# EAGLE schematic APSR3350 (EAGLE 9.5.0)
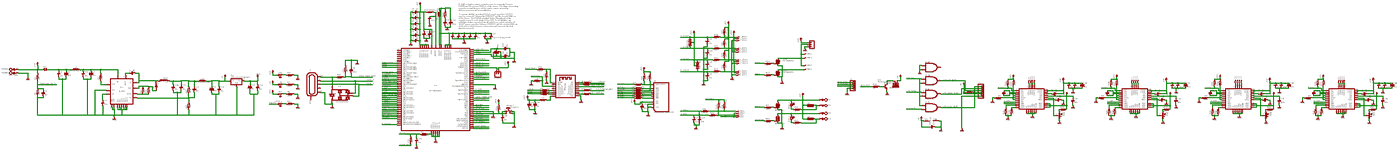
[diagram p0: schematic, sheet 1, overview]
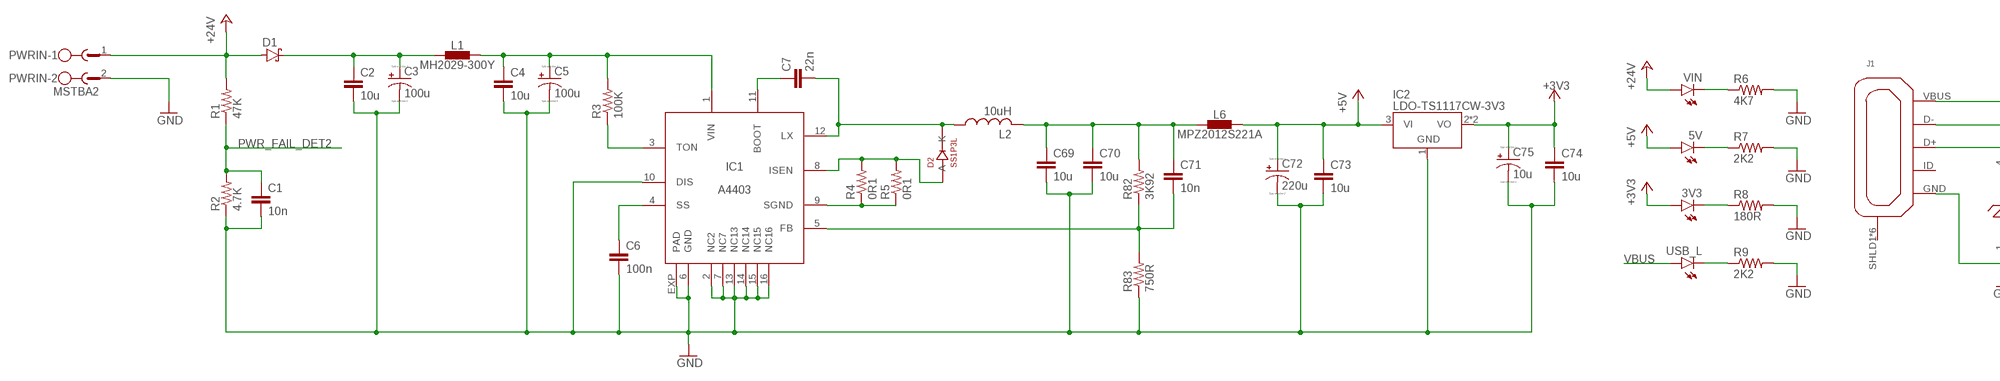
[diagram p1: schematic, sheet 1, part 1 of 5]
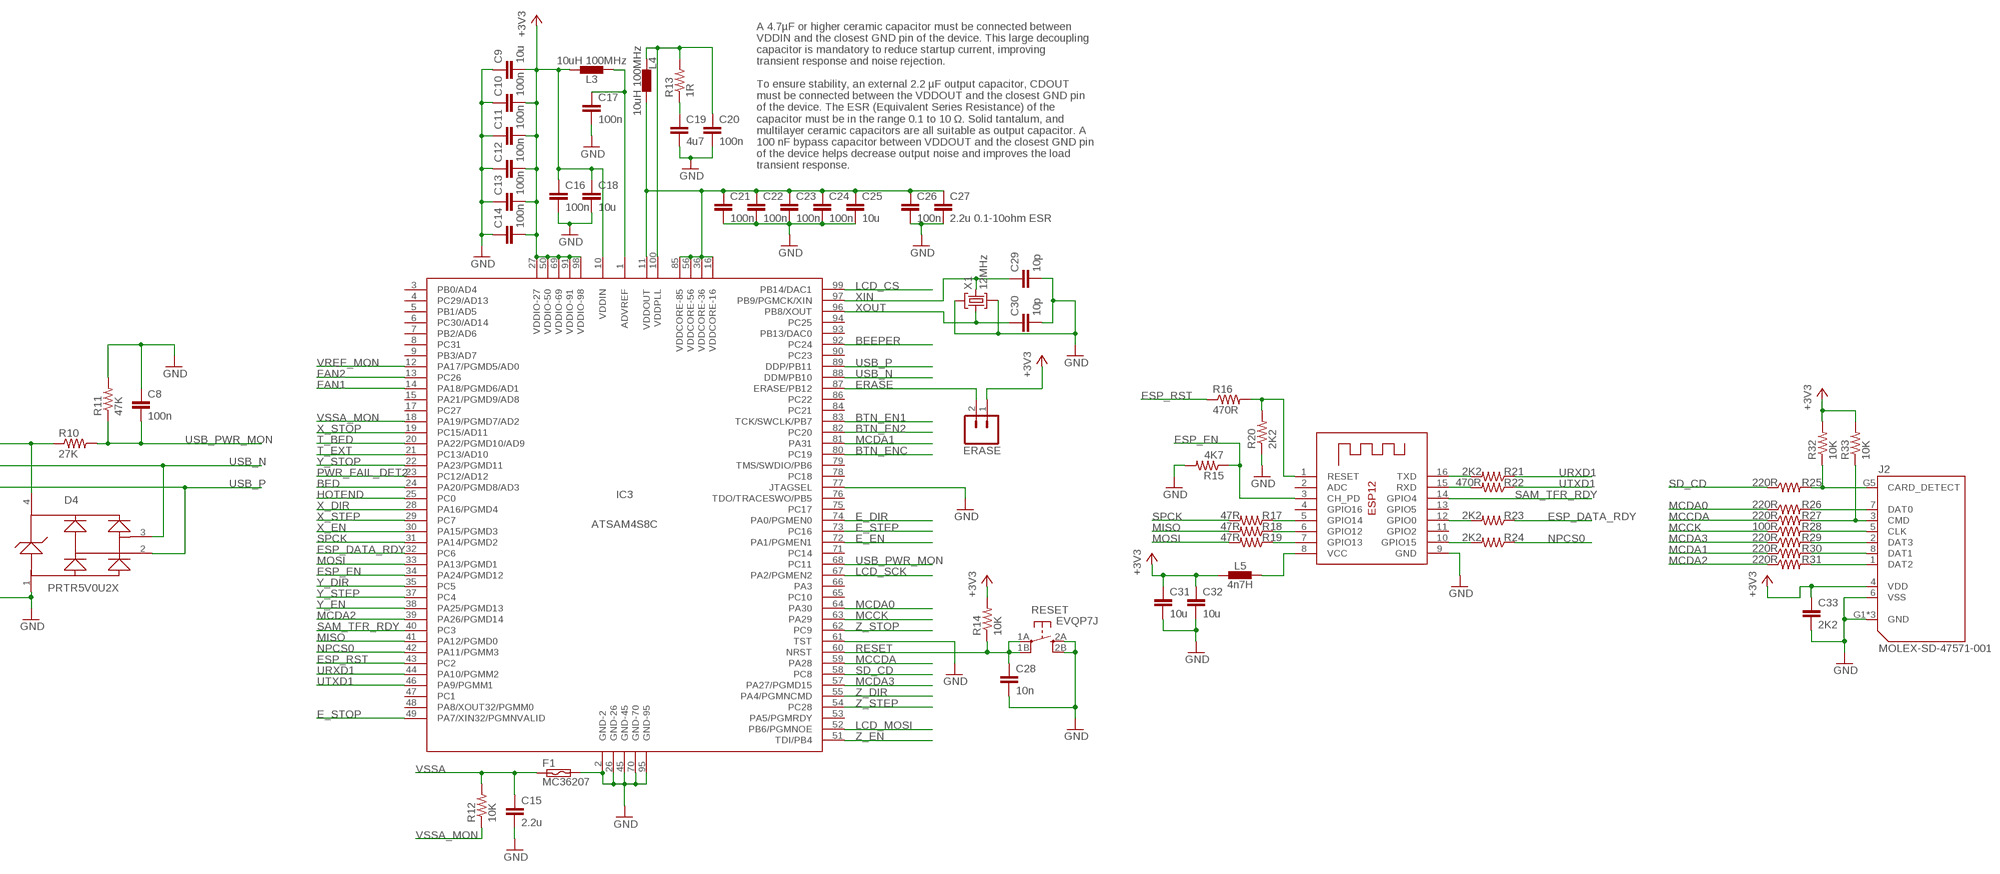
[diagram p2: schematic, sheet 1, part 2 of 5]
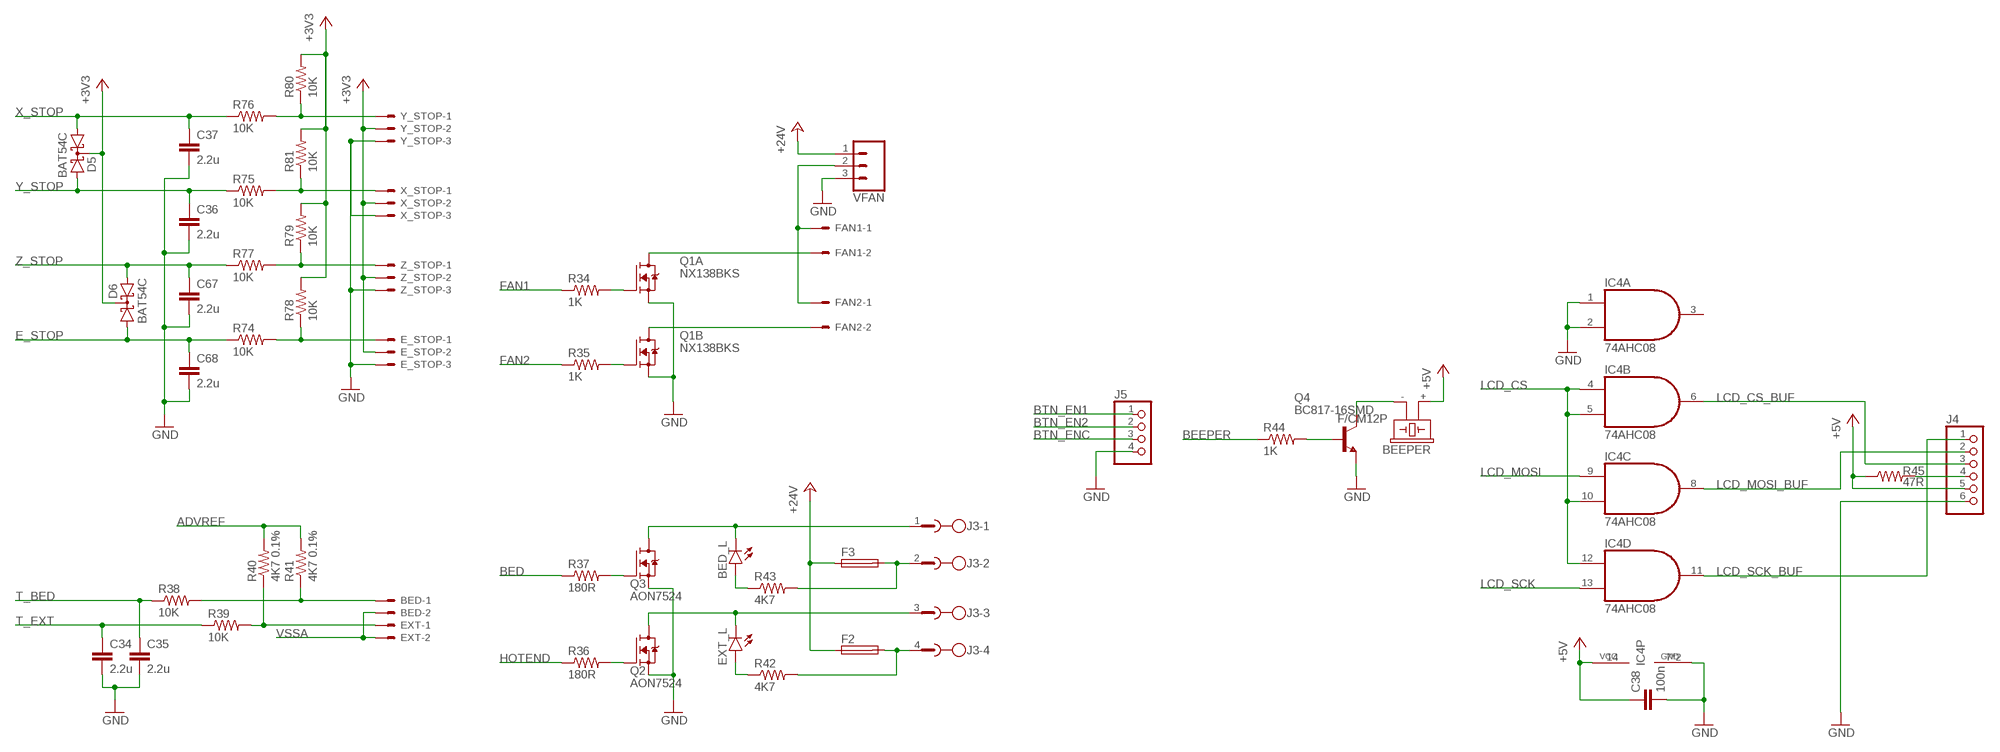
[diagram p3: schematic, sheet 1, part 3 of 5]
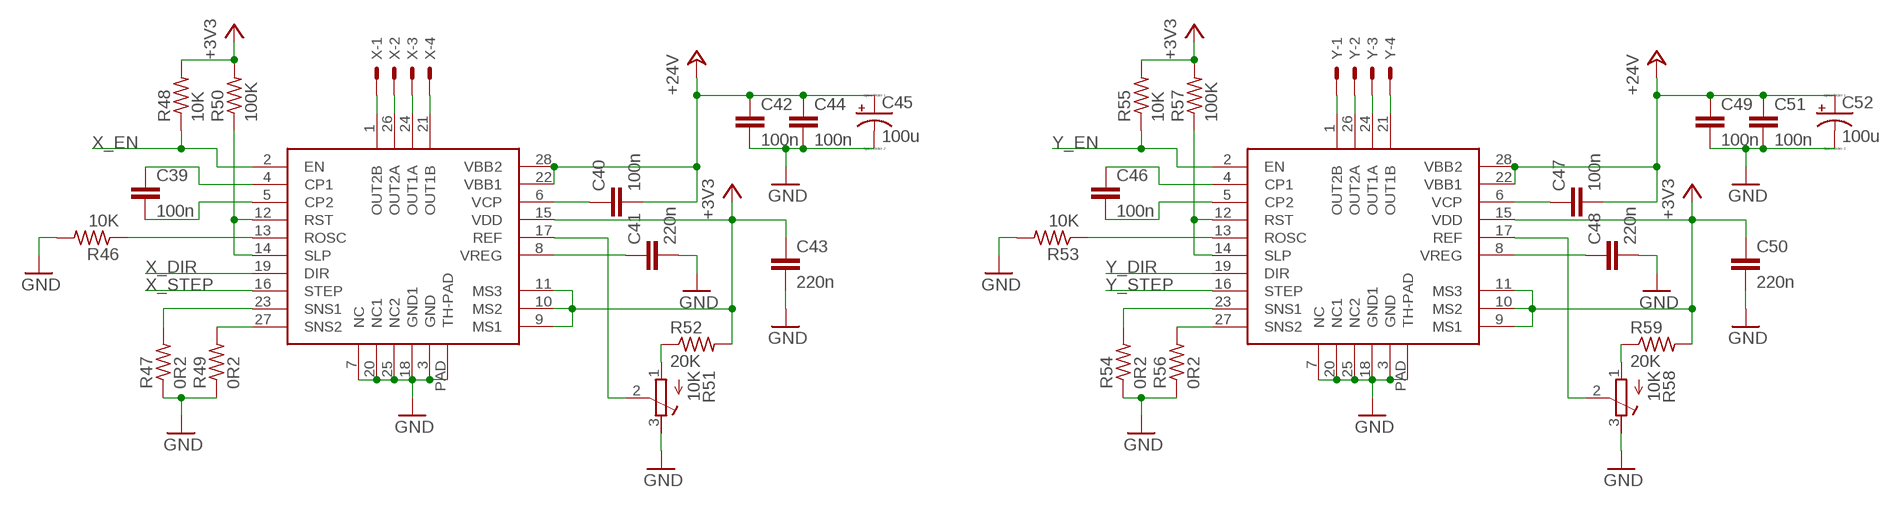
[diagram p4: schematic, sheet 1, part 4 of 5]
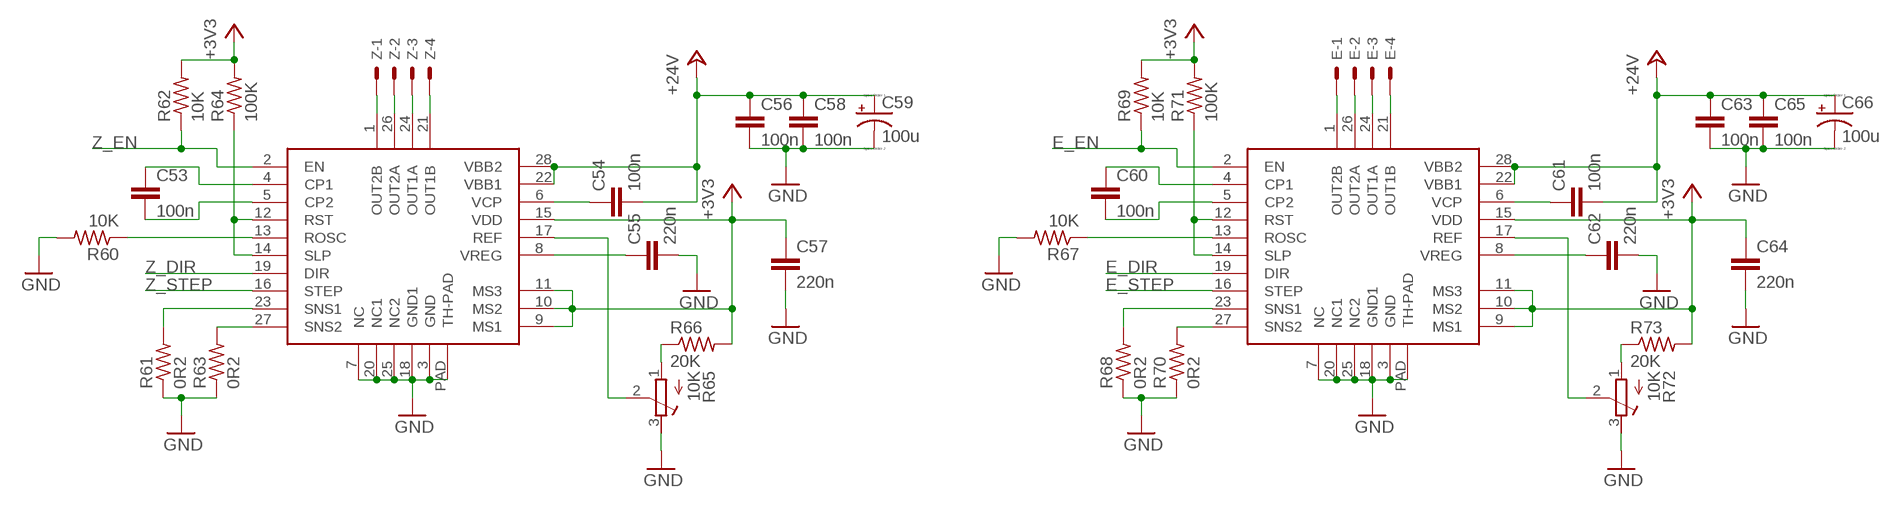
[diagram p5: schematic, sheet 1, part 5 of 5]

## Parts
3V3  LEDCHIPLED_0805  [CHIPLED_0805]
5V  LEDCHIPLED_0805  [CHIPLED_0805]
BED  KK-254-2  [MOLEX-KK-254-2]
BED_L  LEDCHIPLED_0805  [CHIPLED_0805]
BEEPER  F/CM12P  [F/CM12P]
C1  10n  C-EUC0603  [C0603]
C2  10u  C-EUC0603  [C0603]
C3  100u  CPOL-USD  [PANASONIC_D]
C4  10u  C-EUC0603  [C0603]
C5  100u  CPOL-USD  [PANASONIC_D]
C6  100n  C-EUC0603  [C0603]
C7  22n  C-EUC0603  [C0603]
C8  100n  C-EUC0603  [C0603]
C9  10u  C-EUC0805  [C0805]
C10  100n  C-EUC0603  [C0603]
C11  100n  C-EUC0603  [C0603]
C12  100n  C-EUC0603  [C0603]
C13  100n  C-EUC0603  [C0603]
C14  100n  C-EUC0603  [C0603]
C15  2.2u  C-EUC0603  [C0603]
C16  100n  C-EUC0603  [C0603]
C17  100n  C-EUC0603  [C0603]
C18  10u  C-EUC0603  [C0603]
C19  4u7  C-EUC0603  [C0603]
C20  100n  C-EUC0603  [C0603]
C21  100n  C-EUC0603  [C0603]
C22  100n  C-EUC0603  [C0603]
C23  100n  C-EUC0603  [C0603]
C24  100n  C-EUC0603  [C0603]
C25  10u  C-EUC0805  [C0805]
C26  100n  C-EUC0603  [C0603]
C27  2.2u 0.1-10ohm ESR  C-EUC0603  [C0603]
C28  10n  C-EUC0603  [C0603]
C29  10p  C-EUC0603  [C0603]
C30  10p  C-EUC0603  [C0603]
C31  10u  C-EUC0603  [C0603]
C32  10u  C-EUC0603  [C0603]
C33  2K2  C-EUC0603  [C0603]
C34  2.2u  C-EUC0603  [C0603]
C35  2.2u  C-EUC0603  [C0603]
C36  2.2u  C-EUC0603  [C0603]
C37  2.2u  C-EUC0603  [C0603]
C38  100n  C-EUC0603  [C0603]
C39  100n  C-EUC0603  [C0603]
C40  100n  C-EUC0603  [C0603]
C41  220n  C-EUC0603  [C0603]
C42  100n  C-EUC0603  [C0603]
C43  220n  C-EUC0603  [C0603]
C44  100n  C-EUC0603  [C0603]
C45  100u  CPOL-USD  [PANASONIC_D]
C46  100n  C-EUC0603  [C0603]
C47  100n  C-EUC0603  [C0603]
C48  220n  C-EUC0603  [C0603]
C49  100n  C-EUC0603  [C0603]
C50  220n  C-EUC0603  [C0603]
C51  100n  C-EUC0603  [C0603]
C52  100u  CPOL-USD  [PANASONIC_D]
C53  100n  C-EUC0603  [C0603]
C54  100n  C-EUC0603  [C0603]
C55  220n  C-EUC0603  [C0603]
C56  100n  C-EUC0603  [C0603]
C57  220n  C-EUC0603  [C0603]
C58  100n  C-EUC0603  [C0603]
C59  100u  CPOL-USD  [PANASONIC_D]
C60  100n  C-EUC0603  [C0603]
C61  100n  C-EUC0603  [C0603]
C62  220n  C-EUC0603  [C0603]
C63  100n  C-EUC0603  [C0603]
C64  220n  C-EUC0603  [C0603]
C65  100n  C-EUC0603  [C0603]
C66  100u  CPOL-USD  [PANASONIC_D]
C67  2.2u  C-EUC0603  [C0603]
C68  2.2u  C-EUC0603  [C0603]
C69  10u  C-EUC0603  [C0603]
C70  10u  C-EUC0603  [C0603]
C71  10n  C-EUC0603  [C0603]
C72  220u  CPOL-USD  [PANASONIC_D]
C73  10u  C-EUC0603  [C0603]
C74  10u  C-EUC0603  [C0603]
C75  10u  CPOL-USD  [PANASONIC_D]
D1  SCHOTTKY-DIODESMD  [SMB]
D2  SS1P3L  0025_SS1P3L-M3/84A  [DO220AAL]
D4  PRTR5V0U2XB  [SOT143B]
D5  BAT54C  [SOT23]
D6  BAT54C  [SOT23]
E  KK-254-4  [MOLEX-KK-254-4]
E_STOP  KK-254-3  [MOLEX-KK-254-3]
ERASE  CONN_02  [1X02]
ESP8266  ESP-12  [ESP-12]
EXT  KK-254-2  [MOLEX-KK-254-2]
EXT_L  LEDCHIPLED_0805  [CHIPLED_0805]
F1  MC36207  [MC36207]
F2  19560  [19560]
F3  19560  [19560]
FAN1  KK-254-2  [MOLEX-KK-254-2]
FAN2  KK-254-2  [MOLEX-KK-254-2]
IC1  A4403  [QFN16-4X4]
IC2  LDO-TS1117CW-3V3  [SOT223]
IC3  ATSAM4S8C  [LQFP100]
IC4  74AHC08  [DHVQFN14]
IC7  A4988  [QFN28-TP]
IC8  A4988  [QFN28-TP]
IC9  A4988  [QFN28-TP]
IC10  A4988  [QFN28-TP]
J1  ZX62-AB-5PA  [USB-MICRO-10103594]
J2  MOLEX-SD-47571-001  [MOLEX-47571]
J3  MSTBV4  [MSTBV4]
J4  PINHD-1X6  [1X06]
J5  PINHD-1X4  [1X04]
L1  MH2029-300Y  INDUCTOR-0805  [C0805]
L2  10uH  L-USSRR0604  [SRR0604]
L3  10uH 100MHz  INDUCTOR-0603  [C0603]
L4  10uH 100MHz  INDUCTOR-0603  [C0603]
L5  4n7H  INDUCTOR-0603  [C0603]
L6  MPZ2012S221A  INDUCTOR-0805  [C0805]
PWRIN  MSTBA2  [MSTBA2]
Q1  NX138BKS  [SOT363_PHILIPS]
Q2  AON7524  [3X3DFN-EP]
Q3  AON7524  [3X3DFN-EP]
Q4  BC817-16SMD  [SOT23-BEC]
R1  47K  R-US_R0603  [R0603]
R2  4.7K  R-US_R0603  [R0603]
R3  100K  R-US_R0603  [R0603]
R4  0R1  R-US_R0603  [R0603]
R5  0R1  R-US_R0603  [R0603]
R6  4K7  R-US_R0603  [R0603]
R7  2K2  R-US_R0603  [R0603]
R8  180R  R-US_R0603  [R0603]
R9  2K2  R-US_R0603  [R0603]
R10  27K  R-US_R0603  [R0603]
R11  47K  R-US_R0603  [R0603]
R12  10K  R-US_R0603  [R0603]
R13  1R  R-US_R0603  [R0603]
R14  10K  R-US_R0603  [R0603]
R15  4K7  R-US_R0603  [R0603]
R16  470R  R-US_R0603  [R0603]
R17  47R  R-US_R0603  [R0603]
R18  47R  R-US_R0603  [R0603]
R19  47R  R-US_R0603  [R0603]
R20  2K2  R-US_R0603  [R0603]
R21  2K2  R-US_R0603  [R0603]
R22  470R  R-US_R0603  [R0603]
R23  2K2  R-US_R0603  [R0603]
R24  2K2  R-US_R0603  [R0603]
R25  220R  R-US_R0603  [R0603]
R26  220R  R-US_R0603  [R0603]
R27  220R  R-US_R0603  [R0603]
R28  100R  R-US_R0603  [R0603]
R29  220R  R-US_R0603  [R0603]
R30  220R  R-US_R0603  [R0603]
R31  220R  R-US_R0603  [R0603]
R32  10K  R-US_R0603  [R0603]
R33  10K  R-US_R0603  [R0603]
R34  1K  R-US_R0603  [R0603]
R35  1K  R-US_R0603  [R0603]
R36  180R  R-US_R0603  [R0603]
R37  180R  R-US_R0603  [R0603]
R38  10K  R-US_R0603  [R0603]
R39  10K  R-US_R0603  [R0603]
R40  4K7 0.1%  R-US_R0603  [R0603]
R41  4K7 0.1%  R-US_R0603  [R0603]
R42  4K7  R-US_R0603  [R0603]
R43  4K7  R-US_R0603  [R0603]
R44  1K  R-US_R0603  [R0603]
R45  47R  R-US_R0603  [R0603]
R46  10K  R-US_R0603  [R0603]
R47  0R2  R-US_R0805  [R0805]
R48  10K  R-US_R0603  [R0603]
R49  0R2  R-US_R0805  [R0805]
R50  100K  R-US_R0603  [R0603]
R51  10K  R-TRIMM3103  [RTRIM3103]
R52  20K  R-US_R0603  [R0603]
R53  10K  R-US_R0603  [R0603]
R54  0R2  R-US_R0805  [R0805]
R55  10K  R-US_R0603  [R0603]
R56  0R2  R-US_R0805  [R0805]
R57  100K  R-US_R0603  [R0603]
R58  10K  R-TRIMM3103  [RTRIM3103]
R59  20K  R-US_R0603  [R0603]
R60  10K  R-US_R0603  [R0603]
R61  0R2  R-US_R0805  [R0805]
R62  10K  R-US_R0603  [R0603]
R63  0R2  R-US_R0805  [R0805]
R64  100K  R-US_R0603  [R0603]
R65  10K  R-TRIMM3103  [RTRIM3103]
R66  20K  R-US_R0603  [R0603]
R67  10K  R-US_R0603  [R0603]
R68  0R2  R-US_R0805  [R0805]
R69  10K  R-US_R0603  [R0603]
R70  0R2  R-US_R0805  [R0805]
R71  100K  R-US_R0603  [R0603]
R72  10K  R-TRIMM3103  [RTRIM3103]
R73  20K  R-US_R0603  [R0603]
R74  10K  R-US_R0603  [R0603]
R75  10K  R-US_R0603  [R0603]
R76  10K  R-US_R0603  [R0603]
R77  10K  R-US_R0603  [R0603]
R78  10K  R-US_R0603  [R0603]
R79  10K  R-US_R0603  [R0603]
R80  10K  R-US_R0603  [R0603]
R81  10K  R-US_R0603  [R0603]
R82  3K92  R-US_R0603  [R0603]
R83  750R  R-US_R0603  [R0603]
RESET  EVQP7J  [EVQP7]
USB_L  LEDCHIPLED_0805  [CHIPLED_0805]
VFAN  CONN_03SMALL  [1X03_SMALL]
VIN  LEDCHIPLED_0805  [CHIPLED_0805]
X  KK-254-4  [MOLEX-KK-254-4]
X1  12MHz  CRYSTAL-4PIN  [5.0X3.2_KX-9A]
X_STOP  KK-254-3  [MOLEX-KK-254-3]
Y  KK-254-4  [MOLEX-KK-254-4]
Y_STOP  KK-254-3  [MOLEX-KK-254-3]
Z  KK-254-4  [MOLEX-KK-254-4]
Z_STOP  KK-254-3  [MOLEX-KK-254-3]

## Nets
3V3_LED: 3V3.C R8.1
5V_LED: 5V.C R7.1
24V_LED: R6.1 VIN.C
+3V3: 3V3.A C9.2 C10.2 C11.2 C12.2 C13.2 C14.2 C16.1 C18.1 C31.1 C32.1 C33.1 C43.1 C50.1 C57.1 C64.1 C74.1 C75.+ D5.3(CC) D6.3(CC) E_STOP.2 ERASE.1 IC2.2(VO) IC2.4(VO) IC3.10(VDDIN) IC3.27(VDDIO-27) IC3.50(VDDIO-50) IC3.69(VDDIO-69) IC3.91(VDDIO-91) IC3.98(VDDIO-98) IC7.9(MS1) IC7.10(MS2) IC7.11(MS3) IC7.15(VDD) IC8.9(MS1) IC8.10(MS2) IC8.11(MS3) IC8.15(VDD) IC9.9(MS1) IC9.10(MS2) IC9.11(MS3) IC9.15(VDD) IC10.9(MS1) IC10.10(MS2) IC10.11(MS3) IC10.15(VDD) J2.4(VDD) L3.2 L5.1 R14.2 R32.2 R33.2 R48.2 R50.2 R52.2 R55.2 R57.2 R59.2 R62.2 R64.2 R66.2 R69.2 R71.2 R73.2 R78.2 R79.2 R80.2 R81.2 X_STOP.2 Y_STOP.2 Z_STOP.2
+5V [usbvcc]: 5V.A BEEPER.+ C38.1 C72.+ C73.1 IC2.3(VI) IC4.14(P:VCC) J4.5 L6.2 R45.1
+24V: C40.2 C42.1 C44.1 C45.+ C47.2 C49.1 C51.1 C52.+ C54.2 C56.1 C58.1 C59.+ C61.2 C63.1 C65.1 C66.+ D1.A F2.1 F3.1 IC7.22(VBB1) IC7.28(VBB2) IC8.22(VBB1) IC8.28(VBB2) IC9.22(VBB1) IC9.28(VBB2) IC10.22(VBB1) IC10.28(VBB2) PWRIN.1 R1.2 VFAN.1 VIN.A
ADVREF: C17.1 IC3.1(ADVREF) L3.1 R40.2 R41.2
BED: IC3.24(PA20/PGMD8/AD3) R37.1
BED_D: BED_L.C J3.1 Q3.5(D) Q3.6(D) Q3.7(D) Q3.8(D) Q3.E1(D) Q3.E2(D) Q3.PAD(D)
BED_FUSED: F3.2 J3.2 R43.2
BED_G: Q3.4(G) R37.2
BED_L: BED_L.A R43.1
BEEP_G: Q4.B R44.2
BEEP_OUT: BEEPER.- Q4.C
BEEPER: IC3.92(PC24) R44.1
BOOT: C7.1 IC1.11(BOOT)
BTN_EN1: IC3.83(TCK/SWCLK/PB7) J5.1
BTN_EN2: IC3.82(PC20) J5.2
BTN_ENC: IC3.80(PC19) J5.3
CLK: J2.5(CLK) R28.2
CMD: J2.3(CMD) R27.2 R33.1
CON: J4.4 R45.2
CP1E: C60.1 IC10.4(CP1)
CP1X: C39.1 IC7.4(CP1)
CP1Y: C46.1 IC8.4(CP1)
CP1Z: C53.1 IC9.4(CP1)
CP2E: C60.2 IC10.5(CP2)
CP2X: C39.2 IC7.5(CP2)
CP2Y: C46.2 IC8.5(CP2)
CP2Z: C53.2 IC9.5(CP2)
DAT0: J2.7(DAT0) R26.2
DAT1: J2.8(DAT1) R30.2
DAT2: J2.1(DAT2) R31.2
DAT3: J2.2(DAT3) R29.2
DET: J2.G5(CARD_DETECT) R25.2 R32.1
E_DIR: IC3.74(PA0/PGMEN0) IC10.19(DIR)
E_EN: IC3.72(PA1/PGMEN1) IC10.2(EN) R69.1
E_STEP: IC3.73(PC16) IC10.16(STEP)
E_STOP: C68.1 D6.1(A1) IC3.49(PA7/XIN32/PGMNVALID) R74.1
E_STOP_IN: E_STOP.1 R74.2 R78.1
EDR_CONN: ESP8266.12(GPIO0) R23.2
EMOT1A: E.3 IC10.24(OUT1A)
EMOT1B: E.4 IC10.21(OUT1B)
EMOT2A: E.2 IC10.26(OUT2A)
EMOT2B: E.1 IC10.1(OUT2B)
ERASE: ERASE.2 IC3.87(ERASE/PB12)
ESP_CS: ESP8266.10(GPIO15) R24.2
ESP_DATA_RDY: IC3.32(PC6) R23.1
ESP_EN: ESP8266.3(CH_PD) IC3.34(PA24/PGMD12) R15.1
ESP_MISO: ESP8266.6(GPIO12) R18.1
ESP_MOSI: ESP8266.7(GPIO13) R19.1
ESP_RESET: ESP8266.1(RESET) R16.2 R20.2
ESP_RST: IC3.43(PC2) R16.1
ESP_SPCK: ESP8266.5(GPIO14) R17.1
ESP_URDX: ESP8266.16(TXD) R21.2
ESP_UTDX: ESP8266.15(RXD) R22.2
ESP_VIN: ESP8266.8(VCC) L5.2
EXT_D: EXT_L.C J3.3 Q2.5(D) Q2.6(D) Q2.7(D) Q2.8(D) Q2.E1(D) Q2.E2(D) Q2.PAD(D)
EXT_FUSED: F2.2 J3.4 R42.2
EXT_G: Q2.4(G) R36.2
EXT_L: EXT_L.A R42.1
FAN1: IC3.14(PA18/PGMD6/AD1) R34.1
FAN1_D: FAN1.2 Q1.6(A:D)
FAN1_G: Q1.2(A:G) R34.2
FAN2: IC3.13(PC26) R35.1
FAN2_D: FAN2.2 Q1.3(B:D)
FAN2_G: Q1.5(B:G) R35.2
FB: C71.2 IC1.5(FB) R82.1 R83.2
GND: C1.2 C2.2 C3.- C4.2 C5.- C6.2 C8.1 C9.1 C10.1 C11.1 C12.1 C13.1 C14.1 C15.2 C16.2 C17.2 C18.2 C19.2 C20.2 C21.2 C22.2 C23.2 C24.2 C25.2 C26.2 C27.2 C28.2 C29.2 C30.2 C31.2 C32.2 C33.2 C34.2 C35.2 C36.2 C37.2 C38.2 C41.2 C42.2 C43.2 C44.2 C45.- C48.2 C49.2 C50.2 C51.2 C52.- C55.2 C56.2 C57.2 C58.2 C59.- C62.2 C63.2 C64.2 C65.2 C66.- C67.2 C68.2 C69.2 C70.2 C72.- C73.2 C74.2 C75.- D4.1 E_STOP.3 ESP8266.9(GND) F1.2 IC1.2(NC2) IC1.6(GND) IC1.7(NC7) IC1.10(DIS) IC1.13(NC13) IC1.14(NC14) IC1.15(NC15) IC1.16(NC16) IC1.EXP(PAD) IC2.1(GND) IC3.2(GND-2) IC3.26(GND-26) IC3.45(GND-45) IC3.61(TST) IC3.70(GND-70) IC3.77(JTAGSEL) IC3.95(GND-95) IC4.1(A:I0) IC4.2(A:I1) IC4.7(P:GND) IC4.EXP(P:GND) IC7.3(GND) IC7.7(NC) IC7.18(GND1) IC7.20(NC1) IC7.25(NC2) IC7.PAD(TH-PAD) IC8.3(GND) IC8.7(NC) IC8.18(GND1) IC8.20(NC1) IC8.25(NC2) IC8.PAD(TH-PAD) IC9.3(GND) IC9.7(NC) IC9.18(GND1) IC9.20(NC1) IC9.25(NC2) IC9.PAD(TH-PAD) IC10.3(GND) IC10.7(NC) IC10.18(GND1) IC10.20(NC1) IC10.25(NC2) IC10.PAD(TH-PAD) J1.GND J2.6(VSS) J2.G1(GND) J2.G2(GND) J2.G3(GND) J4.6 J5.4 PWRIN.2 Q1.1(A:S) Q1.4(B:S) Q2.1(S) Q2.2(S) Q2.3(S) Q3.1(S) Q3.2(S) Q3.3(S) Q4.E R2.1 R6.2 R7.2 R8.2 R9.2 R11.2 R15.2 R20.1 R46.2 R47.1 R49.1 R51.3(E) R53.2 R54.1 R56.1 R58.3(E) R60.2 R61.1 R63.1 R65.3(E) R67.2 R68.1 R70.1 R72.3(E) R83.1 RESET.2A(S) RESET.2B(S1) VFAN.3 X1.2 X1.4 X_STOP.3 Y_STOP.3 Z_STOP.3
HOTEND: IC3.25(PC0) R36.1
IDEK: C19.1 R13.1
ISEN: D2.P$2(A) IC1.8(ISEN) R4.2 R5.2
LCD_CS: IC3.99(PB14/DAC1) IC4.4(B:I0) IC4.5(B:I1) IC4.10(C:I1) IC4.12(D:I0)
LCD_CS_BUF: IC4.6(B:O) J4.3
LCD_MOSI: IC3.52(PB6/PGMNOE) IC4.9(C:I0)
LCD_MOSI_BUF: IC4.8(C:O) J4.2
LCD_SCK: IC3.67(PA2/PGMEN2) IC4.13(D:I1)
LCD_SCK_BUF: IC4.11(D:O) J4.1
LX: C7.2 D2.P$1(K) IC1.12(LX) L2.P$1
MCCDA: IC3.59(PA28) R27.1
MCCK: IC3.63(PA29) R28.1
MCDA0: IC3.64(PA30) R26.1
MCDA1: IC3.81(PA31) R30.1
MCDA2: IC3.39(PA26/PGMD14) R31.1
MCDA3: IC3.57(PA27/PGMD15) R29.1
MISO: IC3.41(PA12/PGMD0) R18.2
MOSI: IC3.33(PA13/PGMD1) R19.2
NPCS0: IC3.42(PA11/PGMM3) R24.1
PWR_FAIL_DET2: C1.1 IC3.23(PC12/AD12) R1.1 R2.2
REFE: IC10.17(REF) R72.2(S)
REFE-IN: R72.1(A) R73.1
REFX: IC7.17(REF) R51.2(S)
REFX-IN: R51.1(A) R52.1
REFY: IC8.17(REF) R58.2(S)
REFY-IN: R58.1(A) R59.1
REFZ: IC9.17(REF) R65.2(S)
REFZ-IN: R65.1(A) R66.1
RESET: C28.1 IC3.60(NRST) R14.1 RESET.1A(P) RESET.1B(P1)
ROSCE: IC10.13(ROSC) R67.1
ROSCX: IC7.13(ROSC) R46.1
ROSCY: IC8.13(ROSC) R53.1
ROSCZ: IC9.13(ROSC) R60.1
RSTE: IC10.12(RST) IC10.14(SLP) R71.1
RSTX: IC7.12(RST) IC7.14(SLP) R50.1
RSTY: IC8.12(RST) IC8.14(SLP) R57.1
RSTZ: IC9.12(RST) IC9.14(SLP) R64.1
SAM_TFR_RDY: ESP8266.14(GPIO4) IC3.40(PC3)
SD_CD: IC3.58(PC8) R25.1
SGND: IC1.9(SGND) R4.1 R5.1
SNS1E: IC10.23(SNS1) R68.2
SNS1X: IC7.23(SNS1) R47.2
SNS1Y: IC8.23(SNS1) R54.2
SNS1Z: IC9.23(SNS1) R61.2
SNS2E: IC10.27(SNS2) R70.2
SNS2X: IC7.27(SNS2) R49.2
SNS2Y: IC8.27(SNS2) R56.2
SNS2Z: IC9.27(SNS2) R63.2
SPCK: IC3.31(PA14/PGMD2) R17.2
SS: C6.1 IC1.4(SS)
T_BED: C35.1 IC3.20(PA22/PGMD10/AD9) R38.1
T_BED_IN: BED.1 R38.2 R41.1
T_EXT: C34.1 IC3.21(PC13/AD10) R39.1
T_EXT_IN: EXT.1 R39.2 R40.1
TON: IC1.3(TON) R3.1
URXD1: IC3.44(PA10/PGMM2) R21.1
USB_LED: R9.1 USB_L.C
USB_N [diff]: D4.3 IC3.88(DDM/PB10) J1.D-
USB_P [diff]: D4.2 IC3.89(DDP/PB11) J1.D+
USB_PWR_MON: C8.2 IC3.68(PC11) R10.2 R11.1
UTXD1: IC3.46(PA9/PGMM1) R22.1
V_FAN: FAN1.1 FAN2.1 VFAN.2
VBUS: D4.4 J1.VBUS(VUSB) R10.1 USB_L.A
VCPE: C61.1 IC10.6(VCP)
VCPX: C40.1 IC7.6(VCP)
VCPY: C47.1 IC8.6(VCP)
VCPZ: C54.1 IC9.6(VCP)
VDDOUT: C21.1 C22.1 C23.1 C24.1 C25.1 C26.1 C27.1 IC3.11(VDDOUT) IC3.16(VDDCORE-16) IC3.36(VDDCORE-36) IC3.56(VDDCORE-56) IC3.85(VDDCORE-85) L4.2
VDDPLL: C20.1 IC3.100(VDDPLL) L4.1 R13.2
VIN: C2.1 C3.+ D1.C L1.1
VIN_F: C4.1 C5.+ IC1.1(VIN) L1.2 R3.2
VOUT: C69.1 C70.1 C71.1 L2.P$2 L6.1 R82.2
VREF_MON: IC3.12(PA17/PGMD5/AD0)
VREGE: C62.1 IC10.8(VREG)
VREGX: C41.1 IC7.8(VREG)
VREGY: C48.1 IC8.8(VREG)
VREGZ: C55.1 IC9.8(VREG)
VSSA: BED.2 C15.1 EXT.2 F1.1 R12.2
VSSA_MON: IC3.18(PA19/PGMD7/AD2) R12.1
X_DIR: IC3.28(PA16/PGMD4) IC7.19(DIR)
X_EN: IC3.30(PA15/PGMD3) IC7.2(EN) R48.1
X_STEP: IC3.29(PC7) IC7.16(STEP)
X_STOP: C37.1 D5.1(A1) IC3.19(PC15/AD11) R76.1
X_STOP_IN: R76.2 R80.1 Y_STOP.1
XIN: C29.1 IC3.97(PB9/PGMCK/XIN) X1.3
XMOT1A: IC7.24(OUT1A) X.3
XMOT1B: IC7.21(OUT1B) X.4
XMOT2A: IC7.26(OUT2A) X.2
XMOT2B: IC7.1(OUT2B) X.1
XOUT: C30.1 IC3.96(PB8/XOUT) X1.1
Y_DIR: IC3.35(PC5) IC8.19(DIR)
Y_EN: IC3.38(PA25/PGMD13) IC8.2(EN) R55.1
Y_STEP: IC3.37(PC4) IC8.16(STEP)
Y_STOP: C36.1 D5.2(A2) IC3.22(PA23/PGMD11) R75.1
Y_STOP_IN: R75.2 R81.1 X_STOP.1
YMOT1A: IC8.24(OUT1A) Y.3
YMOT1B: IC8.21(OUT1B) Y.4
YMOT2A: IC8.26(OUT2A) Y.2
YMOT2B: IC8.1(OUT2B) Y.1
Z_DIR: IC3.55(PA4/PGMNCMD) IC9.19(DIR)
Z_EN: IC3.51(TDI/PB4) IC9.2(EN) R62.1
Z_STEP: IC3.54(PC28) IC9.16(STEP)
Z_STOP: C67.1 D6.2(A2) IC3.62(PC9) R77.1
Z_STOP_IN: R77.2 R79.1 Z_STOP.1
ZMOT1A: IC9.24(OUT1A) Z.3
ZMOT1B: IC9.21(OUT1B) Z.4
ZMOT2A: IC9.26(OUT2A) Z.2
ZMOT2B: IC9.1(OUT2B) Z.1
Unconnected: ESP8266.2(ADC) ESP8266.4(GPIO16) ESP8266.11(GPIO2) ESP8266.13(GPIO5) IC3.3(PB0/AD4) IC3.4(PC29/AD13) IC3.5(PB1/AD5) IC3.6(PC30/AD14) IC3.7(PB2/AD6) IC3.8(PC31) IC3.9(PB3/AD7) IC3.15(PA21/PGMD9/AD8) IC3.17(PC27) IC3.47(PC1) IC3.48(PA8/XOUT32/PGMM0) IC3.53(PA5/PGMRDY) IC3.65(PC10) IC3.66(PA3) IC3.71(PC14) IC3.75(PC17) IC3.76(TDO/TRACESWO/PB5) IC3.78(PC18) IC3.79(TMS/SWDIO/PB6) IC3.84(PC21) IC3.86(PC22) IC3.90(PC23) IC3.93(PB13/DAC0) IC3.94(PC25) IC4.3(A:O) J1.ID J1.SHLD1(SH) J1.SHLD2(SH) J1.SHLD3(SH) J1.SHLD4(SH) J1.SHLD5(SH) J1.SHLD6(SH)

## Notes on the sheet
- A 4.7µF or higher ceramic capacitor must be connected between
  VDDIN and the closest GND pin of the device. This large decoupling
  capacitor is mandatory to reduce startup current, improving
  transient response and noise rejection.
  
  To ensure stability, an external 2.2 µF output capacitor, CDOUT
  must be connected between the VDDOUT and the closest GND pin
  of the device. The ESR (Equivalent Series Resistance) of the
  capacitor must be in the range 0.1 to 10 Ω. Solid tantalum, and
  multilayer ceramic capacitors are all suitable as output capacitor. A
  100 nF bypass capacitor between VDDOUT and the closest GND pin
  of the device helps decrease output noise and improves the load
  transient response.

## Library data of the parts
3V3 5V BED_L EXT_L USB_L VIN = led:LED: LED OSRAM: - CHIPLED LG R971, LG N971, LY N971, LG Q971, LY Q971, LO R971, LY R971 LH N974, LH R974 LS Q976, LO Q976, LY Q976 LO Q996 - Hyper CHIPLED LW Q18S LB Q993, LB Q99A, LB R99A - SideLED LS A670, LO A670, LY A670, LG A670, LP A670 LB A673, LV A673, LT A673, LW A673 LH A674 LY A675 LS A676, LA A676, LO A676, LY A676, LW A676 LS A679, LY A679, LG A679 - Hyper Micro SIDELED® LS Y876, LA Y876, LO Y876, LY Y876 LT Y87S - SmartLED LW L88C, LW L88S LB L89C, LB L89S, LG L890 LS L89K, LO L89K, LY L89K LS L896, LA L896, LO L896, LY L896 - TOPLED LS T670, LO T670, LY T670, LG T670, LP T670 LSG T670, LSP T670, LSY T670, LOP T670, LYG T670 LG T671, LOG T671, LSG T671 LB T673, LV T673, LT T673, LW T673 LH T674 LS T676, LA T676, LO T676, LY T676, LB T676, LH T676, LSB T676, LW T676 LB T67C, LV T67C, LT T67C, LS T67K, LO T67K, LY T67K, LW E67C LS E67B, LA E67B, LO E67B, LY E67B, LB E67C, LV E67C, LT E67C LW T67C LS T679, LY T679, LG T679 LS T770, LO T770, LY T770, LG T770, LP T770 LB T773, LV T773, LT T773, LW T773 LH T774 LS E675, LA E675, LY E675, LS T675 LS T776, LA T776, LO T776, LY T776, LB T776 LHGB T686 LT T68C, LB T68C - Hyper Mini TOPLED® LB M676 - Mini TOPLED Santana® LG M470 LS M47K, LO M47K, LY M47K Source: http://www.osram.convergy.de LUXEON: - LUMILED® LXK2-PW12-R00, LXK2-PW12-S00, LXK2-PW14-U00, LXK2-PW14-V00 LXK2-PM12-R00, LXK2-PM12-S00, LXK2-PM14-U00 LXK2-PE12-Q00, LXK2-PE12-R00, LXK2-PE12-S00, LXK2-PE14-T00, LXK2-PE14-U00 LXK2-PB12-K00, LXK2-PB12-L00, LXK2-PB12-M00, LXK2-PB14-N00, LXK2-PB14-P00, LXK2-PB14-Q00 LXK2-PR12-L00, LXK2-PR12-M00, LXK2-PR14-Q00, LXK2-PR14-R00 LXK2-PD12-Q00, LXK2-PD12-R00, LXK2-PD12-S00 LXK2-PH12-R00, LXK2-PH12-S00 LXK2-PL12-P00, LXK2-PL12-Q00, LXK2-PL12-R00 Source: www.luxeon.com KINGBRIGHT: KA-3528ASYC Source: www.kingbright.com
BED EXT FAN1 FAN2 = con-other:KK-254-2
BEEPER = buzzer:F/CM12P: BUZZER Source: Buerklin; OC_FARNELL: unknown; OC_NEWARK: unknown
C1 C2 C4 C6-C44 C46-C51 C53-C58 C60-C65 C67-C71 C73 C74 = resistor:C-EU: CAPACITOR, European symbol
C3 C5 C45 C52 C59 C66 C72 C75 = resistor:CPOL-US: POLARIZED CAPACITOR, American symbol
D1 = diode:SCHOTTKY-DIODE: Schottky Diode
D2 = Diodi:0025_SS1P3L-M3/84A: 1A 30V Schottky Barrier Rectifiers -SS1P3L-M3/84A; CASE: SMP; MONTHLY_USAGE: _____; PART_NUMBER: SS1P3L-M3/84A; PRICE: _____; SUPPLIER: _____; TYPE: Diodi
D4 = Arduino:PRTR5V0U2X
D5 D6 = diode:BAT54C: Schottky Diodes Source: Fairchild .. BAT54.pdf
E X Y Z = con-other:KK-254-4
E_STOP X_STOP Y_STOP Z_STOP = con-other:KK-254-3
ERASE = SparkFun-Connectors:CONN_02: Multi connection point. Often used as Generic Header-pin footprint for 0.1 inch spaced/style header connections On any of the 0.1 inch spaced packages, you can populate with these: Break Away Headers - Straight <https://www.sparkfun.com/products/116> (PRT-00116) Break Away Male Headers - Right Angle <https://www.sparkfun.com/products/553> (PRT-00553) Female Headers <https://www.sparkfun.com/products/115> (PRT-00115) Break Away Headers - Machine Pin <https://www.sparkfun.com/products/117> (PRT-00117) Break Away Female Headers - Swiss Machine Pin <https://www.sparkfun.com/products/743> (PRT-00743) For SCREWTERMINALS and SPRING TERMINALS visit here: Screw Terimnals on SparkFun.com <https://www.sparkfun.com/search/results?term=Screw+Terminals> (5mm/3.5mm/2.54mm spacing) This device is also useful as a general connection point to wire up your design to another part of your project. Our various solder wires solder well into these plated through hole pads. Hook-Up Wire - Assortment (Stranded, 22 AWG) <https://www.sparkfun.com/products/11375> (PRT-11375) Hook-Up Wire - Assortment (Solid Core, 22 AWG) <https://www.sparkfun.com/products/11367> (PRT-11367) View the entire wire category on our website here <https://www.sparkfun.com/categories/141> Special notes: Molex polarized connector foot print use with: PRT-08233 with associated crimp pins and housings. 2.54_SCREWTERM for use with PRT-10571. 3.5mm Screw Terminal footprints for PRT-08084 5mm Screw Terminal footprints for use with PRT-08432
ESP8266 = adafruit:ESP-12
F1 = misc:MC36207
F2 F3 = fuse:19560: FUSE HOLDER TR5, Wickmann; MPN: 56000001009; OC_FARNELL: 1185363; OC_NEWARK: 15P8392
IC1 = misc:A4403
IC2 = we-power:LDO: LDOs TS1117 800mA max 15V - compatible NCP1117 1A max 20V TS9011 250mA max 12V - compatible AP2210 300mA max 15V TS5204 150mA max 16V
IC3 = misc:ATSAM4S8C
IC4 = misc:74AHC08
IC7-IC10 = RepRapjr:A4988
J1 = Arduino:ZX62-AB-5PA
J2 = misc:MOLEX-SD
J3 = con-phoenix-508:MSTBV4: PHOENIX; MPN: MSTBV 2,5/4-GF-5.08; OC_FARNELL: 1792794; OC_NEWARK: 69R9847
J4 = pinhead:PINHD-1X6: PIN HEADER
J5 = pinhead:PINHD-1X4: PIN HEADER
L1 L6 = Arduino:INDUCTOR: Inductors
L2 = Arduino-DUE-V03:L-US: INDUCTOR, American symbol
L3-L5 = Zero_V1.0:INDUCTOR: Inductors
PWRIN = con-phoenix-508:MSTBA2: PHOENIX; MF: FARNELL; MPN: 1757242; OC_FARNELL: 3705171; OC_NEWARK: 71C4161
Q1 = misc:NX138BKS
Q2 Q3 = misc:AON7524
Q4 = transistor-npn:BC817*: NPN Transistor
R1-R50 R52-R57 R59-R64 R66-R71 R73-R83 = resistor:R-US_: RESISTOR, American symbol
R51 R58 R65 R72 = resistor:R-TRIMM: Trimm resistor
RESET = misc:EVQP7J
VFAN = SparkFun-Connectors:CONN_03: Multi connection point. Often used as Generic Header-pin footprint for 0.1 inch spaced/style header connections On any of the 0.1 inch spaced packages, you can populate with these: Break Away Headers - Straight <https://www.sparkfun.com/products/116> (PRT-00116) Break Away Male Headers - Right Angle <https://www.sparkfun.com/products/553> (PRT-00553) Female Headers <https://www.sparkfun.com/products/115> (PRT-00115) Break Away Headers - Machine Pin <https://www.sparkfun.com/products/117> (PRT-00117) Break Away Female Headers - Swiss Machine Pin <https://www.sparkfun.com/products/743> (PRT-00743) Stackable Header - 3 Pin (Female, 0.1") <https://www.sparkfun.com/products/13875> (PRT-13875) For SCREWTERMINALS and SPRING TERMINALS visit here: Screw Terimnals on SparkFun.com <https://www.sparkfun.com/search/results?term=Screw+Terminals> (5mm/3.5mm/2.54mm spacing) This device is also useful as a general connection point to wire up your design to another part of your project. Our various solder wires solder well into these plated through hole pads. Hook-Up Wire - Assortment (Stranded, 22 AWG) <https://www.sparkfun.com/products/11375> (PRT-11375) Hook-Up Wire - Assortment (Solid Core, 22 AWG) <https://www.sparkfun.com/products/11367> (PRT-11367) View the entire wire category on our website here <https://www.sparkfun.com/categories/141> Special notes: Molex polarized connector foot print use with SKU : PRT-08232 with associated crimp pins and housings.
X1 = misc:CRYSTAL-4PIN

## Net classes
1 USB: width 0.102 mm, drill 0.1 mm
2 gnd: width 0.102 mm, drill 0.1 mm
3 usbvcc: width 0.102 mm, drill 0.1 mm, clearance 0.15 mm
4 diff: width 0.2 mm